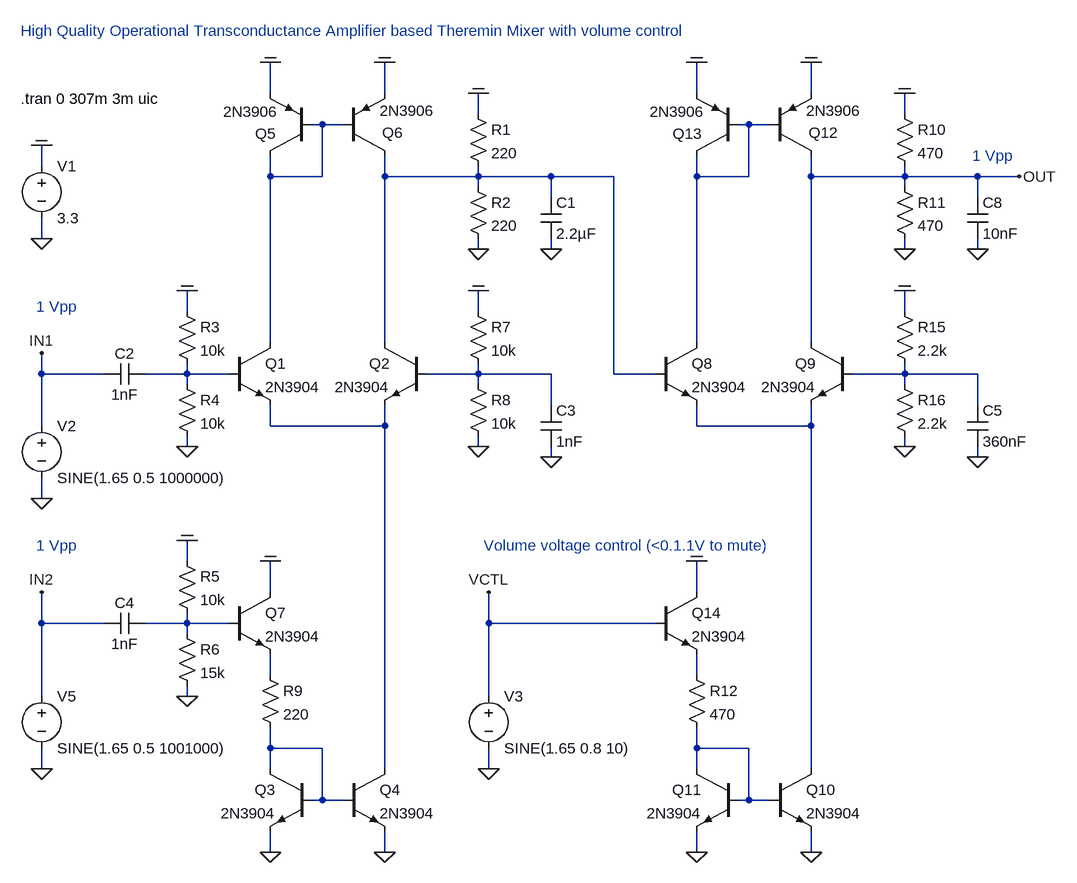
[diagram p0: schematic 2023_04_bjt_trans_cond_mixer_with_volume_vca_v01.asc]
2023_04_bjt_trans_cond_mixer_with_volume_vca_v01.asc, the LTspice schematic file:
Version 4
SHEET 1 16292 17284
WIRE 6320 10720 6320 10672
WIRE 6496 10720 6496 10672
WIRE 6976 10720 6976 10672
WIRE 7152 10720 7152 10672
WIRE 6640 10752 6640 10720
WIRE 7296 10752 7296 10720
WIRE 6400 10768 6384 10768
WIRE 6432 10768 6400 10768
WIRE 7056 10768 7040 10768
WIRE 7088 10768 7056 10768
WIRE 5968 10832 5968 10800
WIRE 6320 10848 6320 10816
WIRE 6400 10848 6400 10768
WIRE 6400 10848 6320 10848
WIRE 6496 10848 6496 10816
WIRE 6640 10848 6640 10832
WIRE 6640 10848 6496 10848
WIRE 6752 10848 6640 10848
WIRE 6848 10848 6752 10848
WIRE 6976 10848 6976 10816
WIRE 7056 10848 7056 10768
WIRE 7056 10848 6976 10848
WIRE 7152 10848 7152 10816
WIRE 7296 10848 7296 10832
WIRE 7296 10848 7152 10848
WIRE 7408 10848 7296 10848
WIRE 7472 10848 7408 10848
WIRE 6640 10864 6640 10848
WIRE 7296 10864 7296 10848
WIRE 6752 10880 6752 10848
WIRE 7408 10880 7408 10848
WIRE 5968 10944 5968 10912
WIRE 6640 10960 6640 10944
WIRE 6752 10960 6752 10944
WIRE 7296 10960 7296 10944
WIRE 7408 10960 7408 10944
WIRE 6192 11056 6192 11024
WIRE 6640 11056 6640 11024
WIRE 7296 11056 7296 11024
WIRE 6320 11104 6320 10848
WIRE 6496 11104 6496 10848
WIRE 6976 11104 6976 10848
WIRE 7152 11104 7152 10848
WIRE 5968 11152 5968 11120
WIRE 6064 11152 5968 11152
WIRE 6192 11152 6192 11136
WIRE 6192 11152 6128 11152
WIRE 6256 11152 6192 11152
WIRE 6640 11152 6640 11136
WIRE 6640 11152 6560 11152
WIRE 6752 11152 6640 11152
WIRE 6848 11152 6848 10848
WIRE 6912 11152 6848 11152
WIRE 7296 11152 7296 11136
WIRE 7296 11152 7216 11152
WIRE 7408 11152 7296 11152
WIRE 6192 11168 6192 11152
WIRE 6640 11168 6640 11152
WIRE 7296 11168 7296 11152
WIRE 6752 11200 6752 11152
WIRE 7408 11200 7408 11152
WIRE 5968 11232 5968 11152
WIRE 6320 11232 6320 11200
WIRE 6496 11232 6496 11200
WIRE 6496 11232 6320 11232
WIRE 6976 11232 6976 11200
WIRE 7152 11232 7152 11200
WIRE 7152 11232 6976 11232
WIRE 6192 11264 6192 11248
WIRE 6640 11264 6640 11248
WIRE 7296 11264 7296 11248
WIRE 6752 11280 6752 11264
WIRE 7408 11280 7408 11264
WIRE 5968 11344 5968 11312
WIRE 6192 11440 6192 11408
WIRE 6320 11488 6320 11440
WIRE 6976 11488 6976 11440
WIRE 5968 11536 5968 11488
WIRE 6064 11536 5968 11536
WIRE 6192 11536 6192 11520
WIRE 6192 11536 6128 11536
WIRE 6256 11536 6192 11536
WIRE 6656 11536 6656 11488
WIRE 6912 11536 6656 11536
WIRE 6192 11552 6192 11536
WIRE 6320 11616 6320 11584
WIRE 6976 11616 6976 11584
WIRE 5968 11648 5968 11536
WIRE 6192 11648 6192 11632
WIRE 6656 11648 6656 11536
WIRE 6320 11728 6320 11696
WIRE 6400 11728 6320 11728
WIRE 6976 11728 6976 11696
WIRE 7056 11728 6976 11728
WIRE 5968 11760 5968 11728
WIRE 6320 11760 6320 11728
WIRE 6496 11760 6496 11232
WIRE 6656 11760 6656 11728
WIRE 6976 11760 6976 11728
WIRE 7152 11760 7152 11232
WIRE 6400 11808 6400 11728
WIRE 6400 11808 6384 11808
WIRE 6432 11808 6400 11808
WIRE 7056 11808 7056 11728
WIRE 7056 11808 7040 11808
WIRE 7088 11808 7056 11808
WIRE 6320 11888 6320 11856
WIRE 6496 11888 6496 11856
WIRE 6976 11888 6976 11856
WIRE 7152 11888 7152 11856
FLAG 5968 10944 0
FLAG 5968 10800 COM
FLAG 6496 11888 0
FLAG 6320 11888 0
FLAG 6320 10672 COM
FLAG 5968 11344 0
FLAG 6640 10720 COM
FLAG 6640 10960 0
FLAG 6496 10672 COM
FLAG 6320 11440 COM
FLAG 6192 11408 COM
FLAG 6192 11648 0
FLAG 6640 11024 COM
FLAG 6640 11264 0
FLAG 6192 11024 COM
FLAG 6192 11264 0
FLAG 5968 11760 0
FLAG 6752 11280 0
FLAG 6752 10960 0
FLAG 5968 11120 IN1
FLAG 5968 11488 IN2
FLAG 7152 11888 0
FLAG 6976 11888 0
FLAG 6976 10672 COM
FLAG 7296 10720 COM
FLAG 7296 10960 0
FLAG 7472 10848 OUT
FLAG 7152 10672 COM
FLAG 6976 11440 COM
FLAG 7296 11024 COM
FLAG 7296 11264 0
FLAG 7408 11280 0
FLAG 7408 10960 0
FLAG 6656 11760 0
FLAG 6656 11488 VCTL
SYMBOL voltage 5968 10816 R0
WINDOW 123 0 0 Left 0
WINDOW 39 0 0 Left 0
SYMATTR InstName V1
SYMATTR Value 3.3
SYMBOL npn 6256 11104 R0
SYMATTR InstName Q1
SYMATTR Value 2N3904
SYMBOL npn 6560 11104 M0
SYMATTR InstName Q2
SYMATTR Value 2N3904
SYMBOL npn 6432 11760 R0
SYMATTR InstName Q4
SYMATTR Value 2N3904
SYMBOL npn 6384 11760 M0
SYMATTR InstName Q3
SYMATTR Value 2N3904
SYMBOL pnp 6432 10816 M180
WINDOW 0 60 35 Left 2
WINDOW 3 56 69 Left 2
SYMATTR InstName Q6
SYMATTR Value 2N3906
SYMBOL pnp 6384 10816 R180
WINDOW 0 55 34 Left 2
WINDOW 3 52 68 Left 2
SYMATTR InstName Q5
SYMATTR Value 2N3906
SYMBOL voltage 5968 11216 R0
WINDOW 123 0 0 Left 0
WINDOW 39 0 0 Left 0
SYMATTR InstName V2
SYMATTR Value SINE(1.65 0.5 1000000)
SYMBOL res 6624 10736 R0
WINDOW 0 36 40 Left 2
WINDOW 3 36 76 Left 2
SYMATTR InstName R1
SYMATTR Value 220
SYMBOL res 6624 10848 R0
WINDOW 0 36 40 Left 2
WINDOW 3 36 76 Left 2
SYMATTR InstName R2
SYMATTR Value 220
SYMBOL res 6304 11600 R0
WINDOW 0 36 40 Left 2
WINDOW 3 36 76 Left 2
SYMATTR InstName R9
SYMATTR Value 220
SYMBOL npn 6256 11488 R0
SYMATTR InstName Q7
SYMATTR Value 2N3904
SYMBOL res 6176 11424 R0
WINDOW 0 36 40 Left 2
WINDOW 3 36 76 Left 2
SYMATTR InstName R5
SYMATTR Value 10k
SYMBOL res 6176 11536 R0
WINDOW 0 36 40 Left 2
WINDOW 3 36 76 Left 2
SYMATTR InstName R6
SYMATTR Value 15k
SYMBOL res 6624 11040 R0
WINDOW 0 36 40 Left 2
WINDOW 3 36 76 Left 2
SYMATTR InstName R7
SYMATTR Value 10k
SYMBOL res 6624 11152 R0
WINDOW 0 36 40 Left 2
WINDOW 3 36 76 Left 2
SYMATTR InstName R8
SYMATTR Value 10k
SYMBOL res 6176 11040 R0
WINDOW 0 36 40 Left 2
WINDOW 3 36 76 Left 2
SYMATTR InstName R3
SYMATTR Value 10k
SYMBOL res 6176 11152 R0
WINDOW 0 36 40 Left 2
WINDOW 3 36 76 Left 2
SYMATTR InstName R4
SYMATTR Value 10k
SYMBOL cap 6736 11200 R0
SYMATTR InstName C3
SYMATTR Value 1nF
SYMBOL cap 6128 11136 R90
WINDOW 0 0 32 VBottom 2
WINDOW 3 32 32 VTop 2
SYMATTR InstName C2
SYMATTR Value 1nF
SYMBOL cap 6128 11520 R90
WINDOW 0 0 32 VBottom 2
WINDOW 3 32 32 VTop 2
SYMATTR InstName C4
SYMATTR Value 1nF
SYMBOL voltage 5968 11632 R0
WINDOW 123 0 0 Left 0
WINDOW 39 0 0 Left 0
SYMATTR InstName V5
SYMATTR Value SINE(1.65 0.5 1001000)
SYMBOL cap 6736 10880 R0
SYMATTR InstName C1
SYMATTR Value 2.2µF
SYMBOL npn 6912 11104 R0
SYMATTR InstName Q8
SYMATTR Value 2N3904
SYMBOL npn 7216 11104 M0
SYMATTR InstName Q9
SYMATTR Value 2N3904
SYMBOL npn 7088 11760 R0
SYMATTR InstName Q10
SYMATTR Value 2N3904
SYMBOL npn 7040 11760 M0
SYMATTR InstName Q11
SYMATTR Value 2N3904
SYMBOL pnp 7088 10816 M180
WINDOW 0 60 35 Left 2
WINDOW 3 56 69 Left 2
SYMATTR InstName Q12
SYMATTR Value 2N3906
SYMBOL pnp 7040 10816 R180
WINDOW 0 55 34 Left 2
WINDOW 3 52 68 Left 2
SYMATTR InstName Q13
SYMATTR Value 2N3906
SYMBOL res 7280 10736 R0
WINDOW 0 36 40 Left 2
WINDOW 3 36 76 Left 2
SYMATTR InstName R10
SYMATTR Value 470
SYMBOL res 7280 10848 R0
WINDOW 0 36 40 Left 2
WINDOW 3 36 76 Left 2
SYMATTR InstName R11
SYMATTR Value 470
SYMBOL res 6960 11600 R0
WINDOW 0 36 40 Left 2
WINDOW 3 36 76 Left 2
SYMATTR InstName R12
SYMATTR Value 470
SYMBOL npn 6912 11488 R0
SYMATTR InstName Q14
SYMATTR Value 2N3904
SYMBOL res 7280 11040 R0
WINDOW 0 36 40 Left 2
WINDOW 3 36 76 Left 2
SYMATTR InstName R15
SYMATTR Value 2.2k
SYMBOL res 7280 11152 R0
WINDOW 0 36 40 Left 2
WINDOW 3 36 76 Left 2
SYMATTR InstName R16
SYMATTR Value 2.2k
SYMBOL cap 7392 11200 R0
SYMATTR InstName C5
SYMATTR Value 360nF
SYMBOL cap 7392 10880 R0
SYMATTR InstName C8
SYMATTR Value 10nF
SYMBOL voltage 6656 11632 R0
WINDOW 123 0 0 Left 0
WINDOW 39 0 0 Left 0
SYMATTR InstName V3
SYMATTR Value SINE(1.65 0.8 10)
TEXT 5936 10728 Left 2 !.tran 0 307m 3m uic
TEXT 5936 10624 Left 2 ;High Quality Operational Transconductance Amplifier based Theremin Mixer with volume control
TEXT 5960 11048 Left 2 ;1 Vpp
TEXT 5960 11416 Left 2 ;1 Vpp
TEXT 7400 10816 Left 2 ;1 Vpp
TEXT 6648 11416 Left 2 ;Volume voltage control (<0.1.1V to mute)

The netlist it stands for:
* 2023_04_bjt_trans_cond_mixer_with_volume_vca_v01.asc
V1 COM 0 3.3
Q1 N001 N004 N007 0 2N3904
Q2 N003 N005 N007 0 2N3904
Q4 N007 N012 0 0 2N3904
Q3 N012 N012 0 0 2N3904
Q6 N003 N001 COM 0 2N3906
Q5 N001 N001 COM 0 2N3906
V2 IN1 0 SINE(1.65 0.5 1000000)
R1 COM N003 220
R2 N003 0 220
R9 N010 N012 220
Q7 COM N009 N010 0 2N3904
R5 COM N009 10k
R6 N009 0 15k
R7 COM N005 10k
R8 N005 0 10k
R3 COM N004 10k
R4 N004 0 10k
C3 N005 0 1nF
C2 N004 IN1 1nF
C4 N009 IN2 1nF
V5 IN2 0 SINE(1.65 0.5 1001000)
C1 N003 0 2.2µF
Q8 N002 N003 N008 0 2N3904
Q9 OUT N006 N008 0 2N3904
Q10 N008 N013 0 0 2N3904
Q11 N013 N013 0 0 2N3904
Q12 OUT N002 COM 0 2N3906
Q13 N002 N002 COM 0 2N3906
R10 COM OUT 470
R11 OUT 0 470
R12 N011 N013 470
Q14 COM VCTL N011 0 2N3904
R15 COM N006 2.2k
R16 N006 0 2.2k
C5 N006 0 360nF
C8 OUT 0 10nF
V3 VCTL 0 SINE(1.65 0.8 10)
.model NPN NPN
.model PNP PNP
.lib standard.bjt
.tran 0 307m 3m uic
* High Quality Operational Transconductance Amplifier based Theremin Mixer with volume control
* 1 Vpp
* 1 Vpp
* 1 Vpp
* Volume voltage control (<0.1.1V to mute)
.backanno
.end